# EAGLE design Enable Circuit (EAGLE 7.5.0)
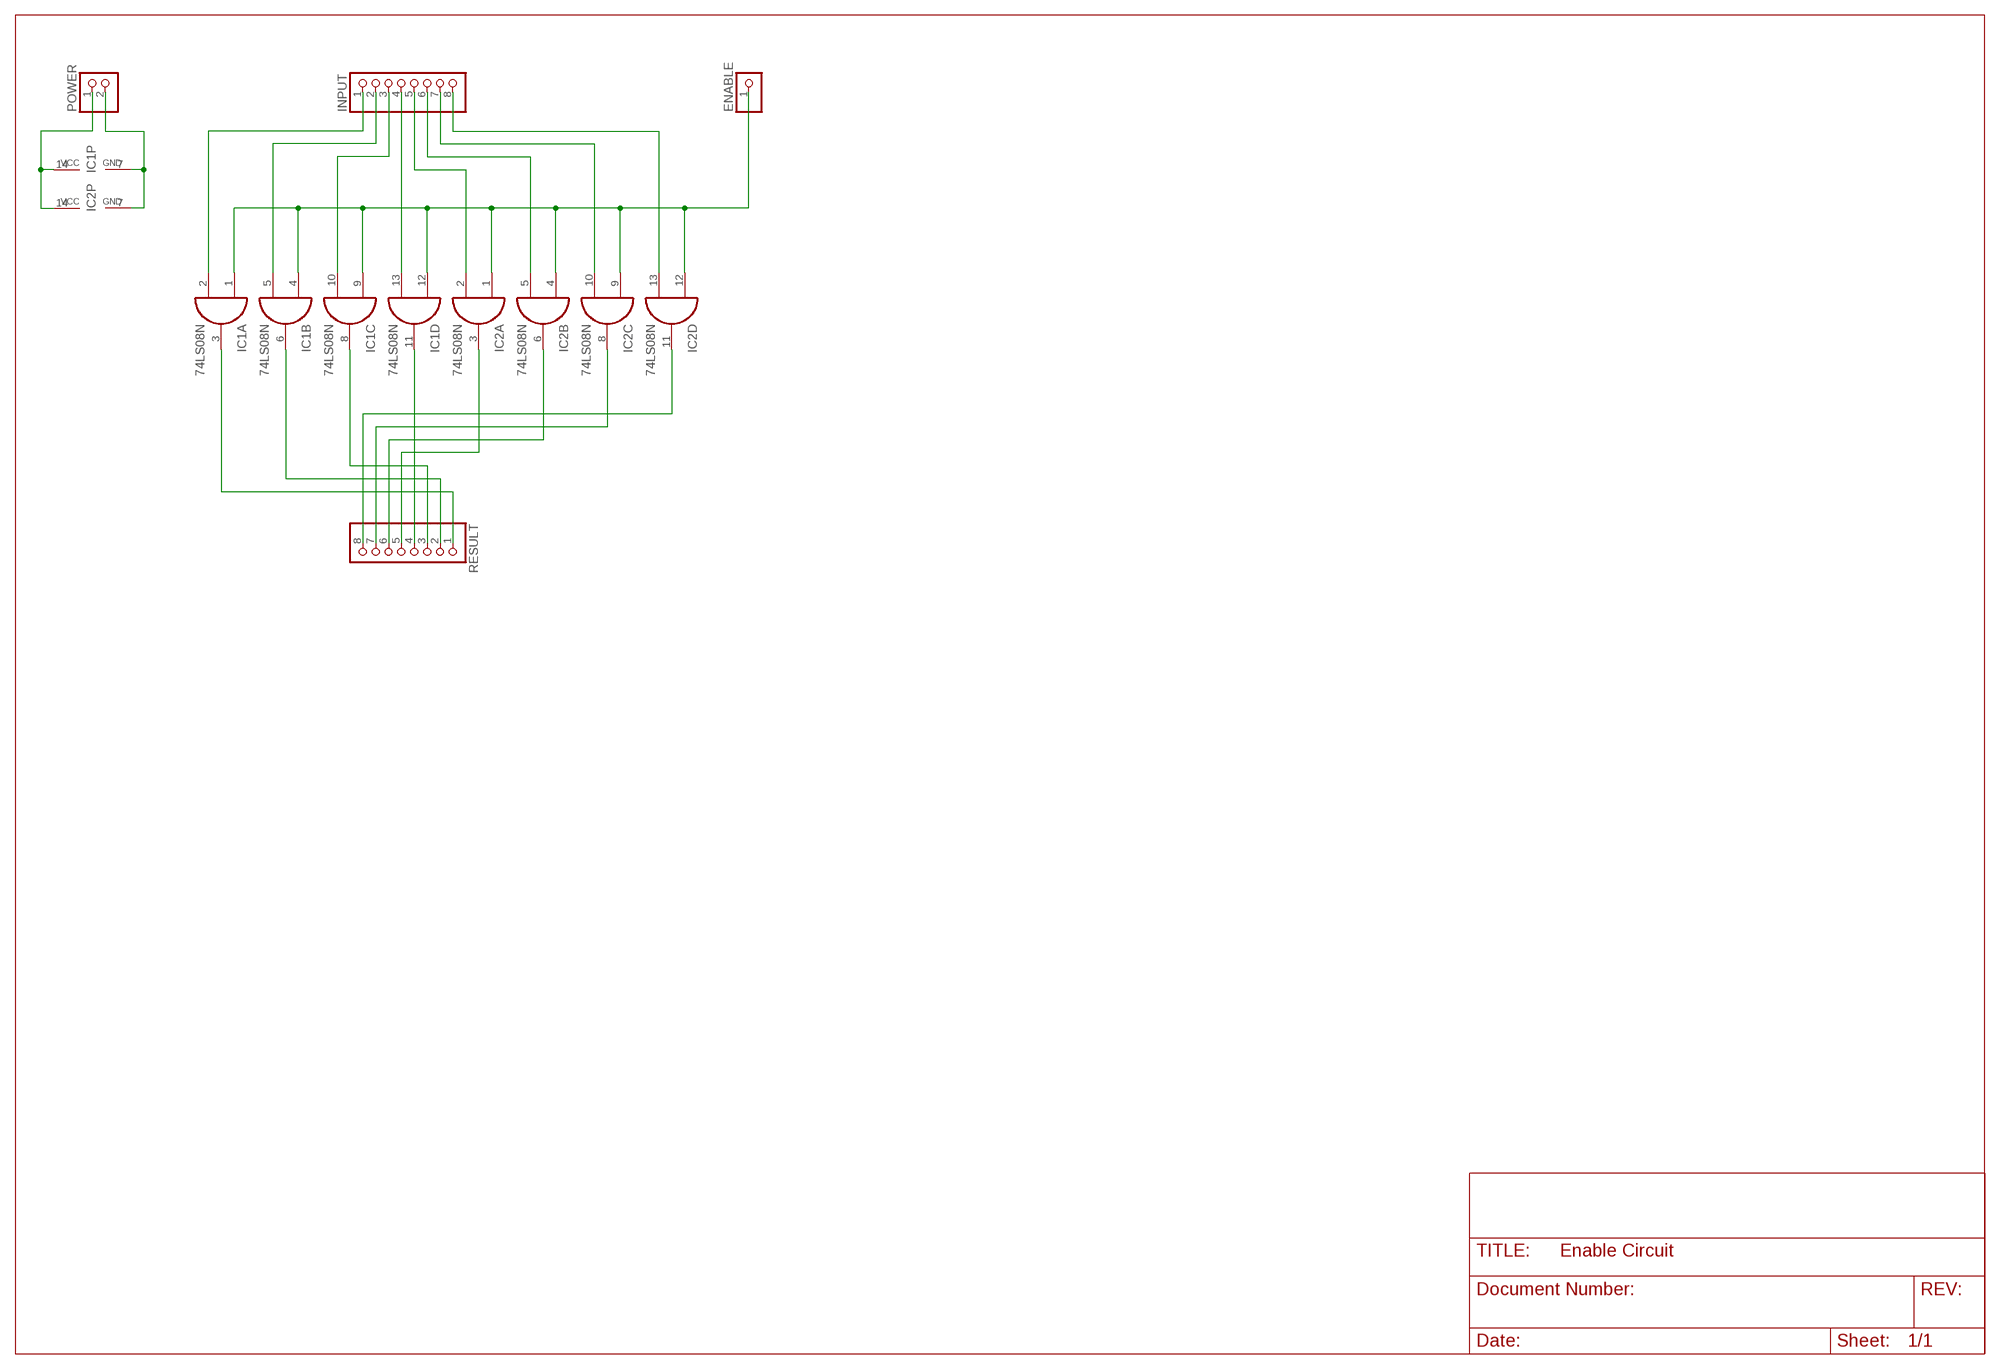
[diagram p0: schematic, sheet 1]

## Parts
ENABLE  PINHD-1X1  [1X01]
IC1  74LS08N  [DIL14]
IC2  74LS08N  [DIL14]
INPUT  PINHD-1X8  [1X08]
POWER  PINHD-1X2  [1X02]
RESULT  PINHD-1X8  [1X08]

## Nets
GND: IC1.7(P:GND) IC2.7(P:GND) POWER.2
N$1: IC1.2(A:I1) INPUT.1
N$2: IC1.5(B:I1) INPUT.2
N$3: IC1.10(C:I1) INPUT.3
N$4: IC1.13(D:I1) INPUT.4
N$5: IC2.2(A:I1) INPUT.5
N$6: IC2.5(B:I1) INPUT.6
N$7: IC2.10(C:I1) INPUT.7
N$8: IC2.13(D:I1) INPUT.8
N$9: ENABLE.1 IC1.1(A:I0) IC1.4(B:I0) IC1.9(C:I0) IC1.12(D:I0) IC2.1(A:I0) IC2.4(B:I0) IC2.9(C:I0) IC2.12(D:I0)
N$10: IC1.3(A:O) RESULT.1
N$11: IC1.6(B:O) RESULT.2
N$12: IC1.8(C:O) RESULT.3
N$13: IC1.11(D:O) RESULT.4
N$14: IC2.3(A:O) RESULT.5
N$15: IC2.6(B:O) RESULT.6
N$16: IC2.8(C:O) RESULT.7
N$17: IC2.11(D:O) RESULT.8
VCC: IC1.14(P:VCC) IC2.14(P:VCC) POWER.1

## Library data of the parts
ENABLE = pinhead:PINHD-1X1: PIN HEADER
IC1 IC2 = 74xx-eu:74*08: Quad 2-input AND gate
INPUT RESULT = pinhead:PINHD-1X8: PIN HEADER
POWER = pinhead:PINHD-1X2: PIN HEADER

## Board
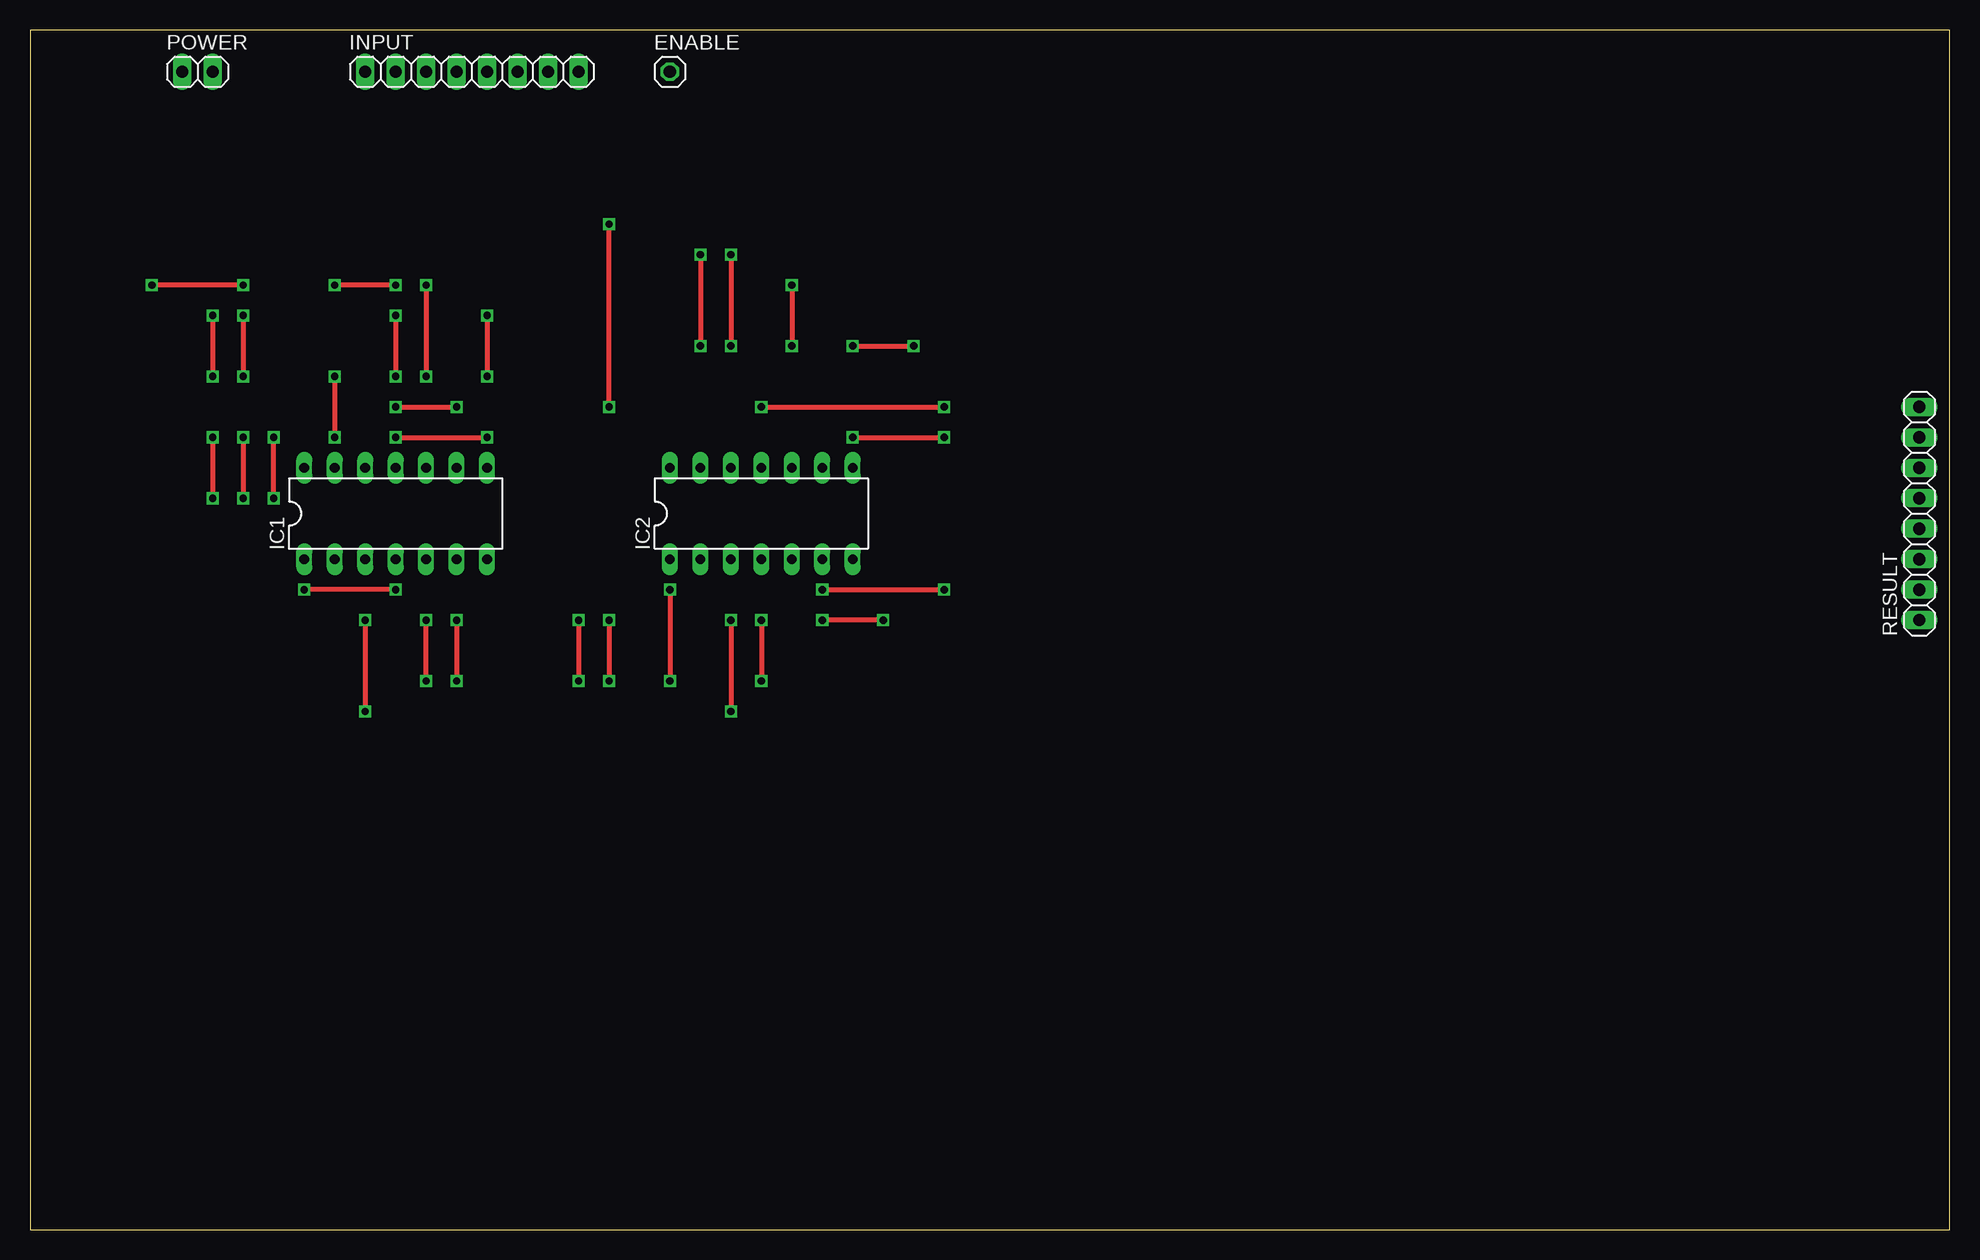
[diagram p1: board, top side]
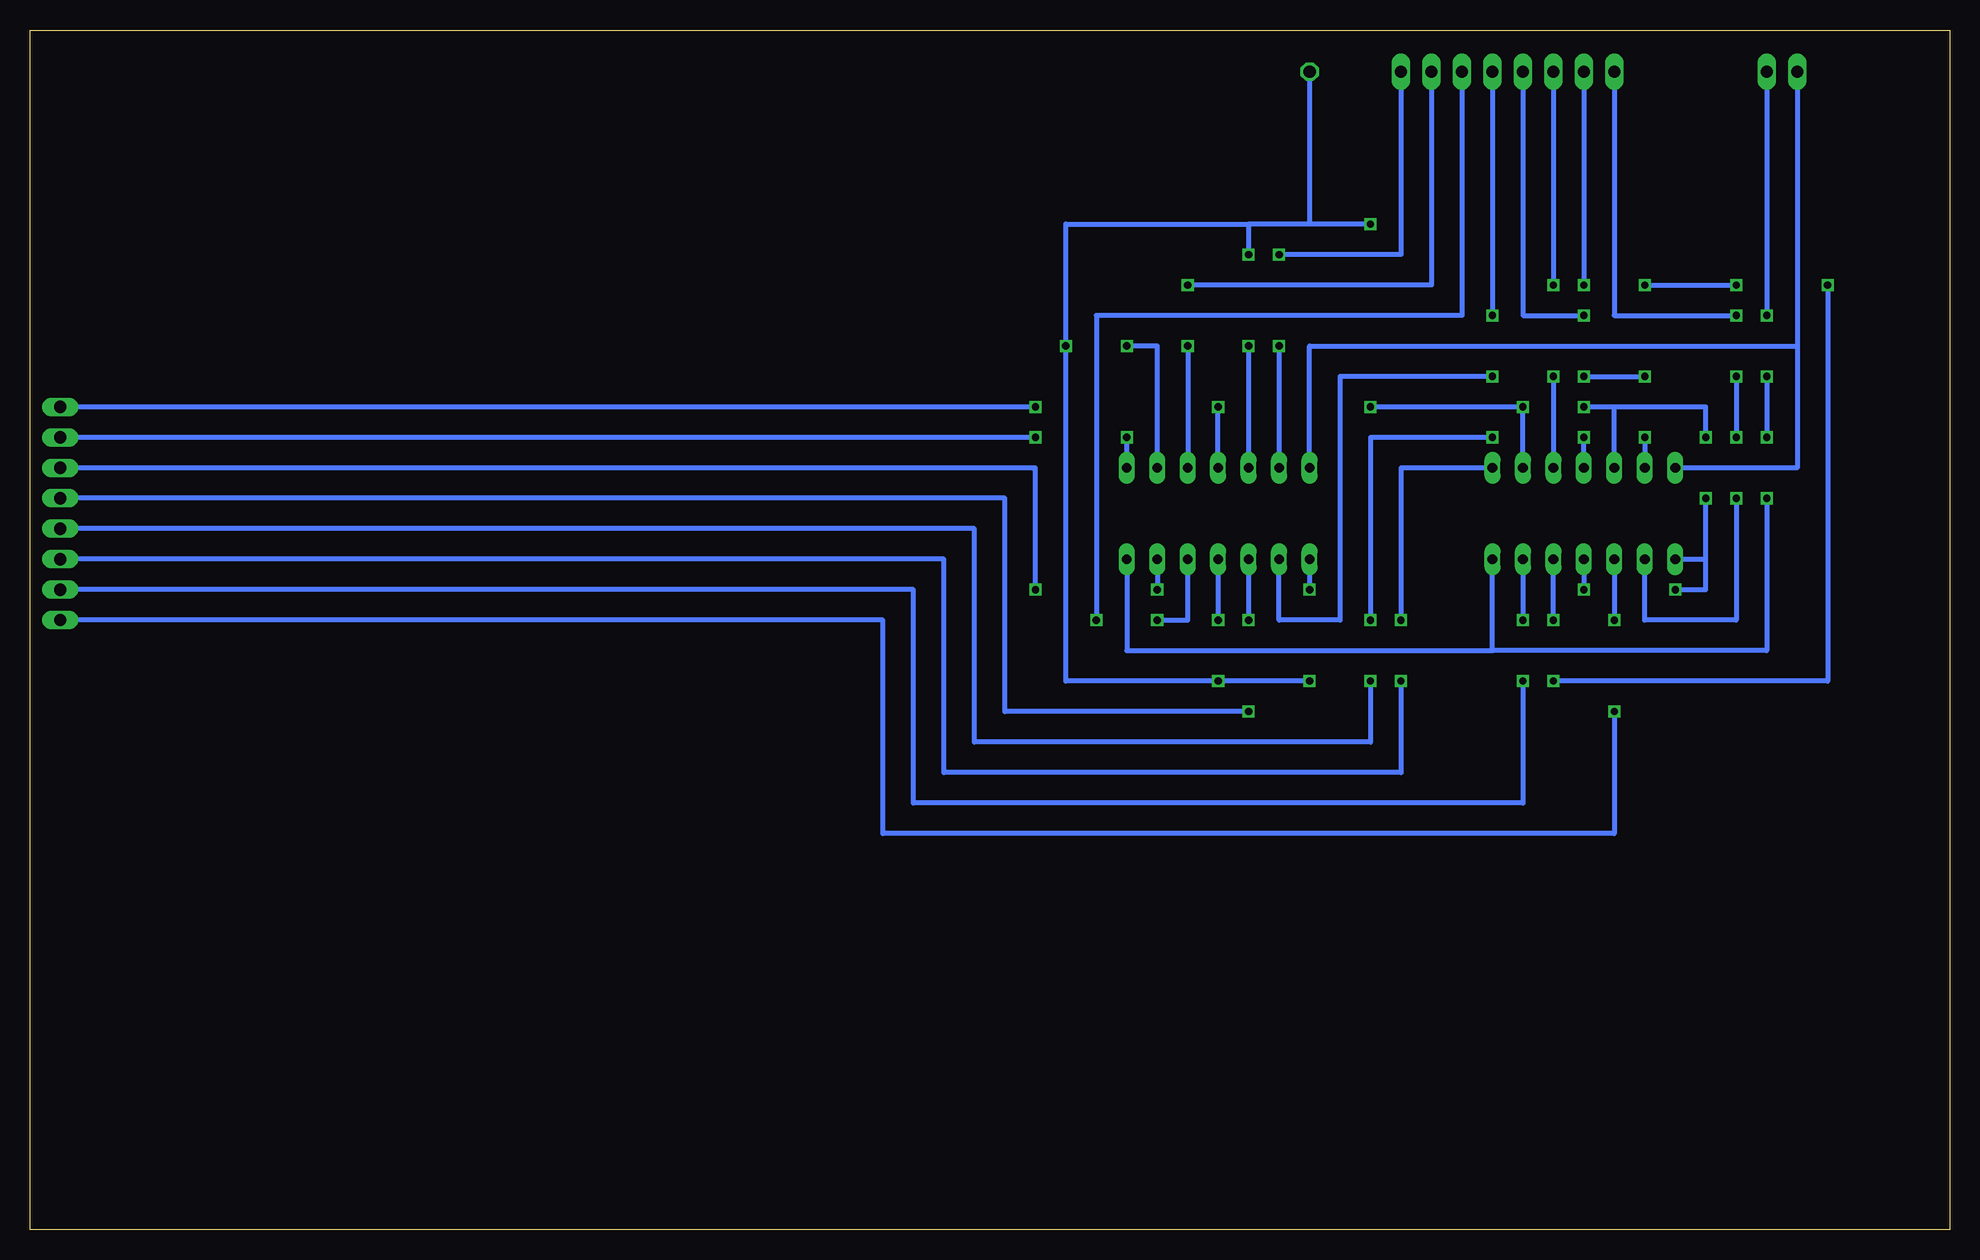
[diagram p2: board, bottom side, seen from below]

Size 160 x 100 mm. Coordinates in mm from the lower left corner, seen from the top.
Outline: 0,0 160,0 160,100 0,100 0,0
Copper layers (1*16): Top 0.035mm / dielectric 1.5mm / Bottom 0.035mm
Design rules "default": minimum track width 10mil, minimum drill 24mil, track to track 8mil, track to pad 8mil, pad to pad 8mil, via to via 8mil, smd to smd 8mil, copper to edge 40mil, drill to drill 8mil, minimum pad ring 10mil, minimum via ring 8mil, stop-mask expansion 4mil, vias tented up to drill 0mil, thermal gap 10mil

### Footprints (pad centres in the part's own frame; a part is rotated, then mirrored left to right if it is on the bottom)
1X01 = drill 1.016 octagon: 1 0,0
DIL14 = drill 0.813 long: 1 -7.62,-3.81; 2 -5.08,-3.81; 3 -2.54,-3.81; 4 0,-3.81; 5 2.54,-3.81; 6 5.08,-3.81; 7 7.62,-3.81; 8 7.62,3.81; 9 5.08,3.81; 10 2.54,3.81; 11 0,3.81; 12 -2.54,3.81; 13 -5.08,3.81; 14 -7.62,3.81
1X08 = drill 1.016 long: 1 -8.89,0; 2 -6.35,0; 3 -3.81,0; 4 -1.27,0; 5 1.27,0; 6 3.81,0; 7 6.35,0; 8 8.89,0
1X02 = drill 1.016 long: 1 -1.27,0; 2 1.27,0

### Placement (x,y rotation side)
ENABLE  53.34,96.52 0 top
IC1  30.48,59.69 0 top
IC2  60.96,59.69 0 top
INPUT  36.83,96.52 0 top
POWER  13.97,96.52 0 top
RESULT  157.48,59.69 90 top

### Tracks (layer width: path | path; a pad name or v marks a point on that pad's centre or on a via)
GND  (via drill 0.6)
  Top 0.406: v15.24,76.2 v15.24,71.12 | v15.24,66.04 v15.24,60.96
  Bottom 0.406: POWER.2 v15.24,76.2 | v15.24,71.12 v15.24,66.04 | v15.24,60.96 15.24,48.26 38.1,48.26 | 38.1,48.26 IC1.7 | IC2.7 68.58,48.26 38.1,48.26
N$1  (via drill 0.6)
  Top 0.406: v17.78,76.2 v17.78,71.12 | v17.78,66.04 v17.78,60.96
  Bottom 0.406: INPUT.1 27.94,76.2 v17.78,76.2 | v17.78,71.12 v17.78,66.04 | v17.78,60.96 17.78,50.8 25.4,50.8 IC1.2
N$2  (via drill 0.6)
  Top 0.406: v30.48,78.74 v25.4,78.74 | v17.78,78.74 v10.16,78.74 | v33.02,45.72 v33.02,50.8
  Bottom 0.406: INPUT.2 v30.48,78.74 | v25.4,78.74 v17.78,78.74 | v10.16,78.74 10.16,45.72 v33.02,45.72 | v33.02,50.8 IC1.5
N$3  (via drill 0.6)
  Top 0.406: v33.02,78.74 v33.02,71.12
  Bottom 0.406: INPUT.3 v33.02,78.74 | v33.02,71.12 IC1.10
N$4  (via drill 0.6)
  Top 0.406: v30.48,76.2 v30.48,71.12 | v25.4,71.12 v25.4,66.04
  Bottom 0.406: INPUT.4 35.56,76.2 v30.48,76.2 | v30.48,71.12 v25.4,71.12 | v25.4,66.04 IC1.13
N$5  (via drill 0.6)
  Top 0.406: v38.1,76.2 v38.1,71.12
  Bottom 0.406: INPUT.5 v38.1,76.2 | v38.1,71.12 50.8,71.12 50.8,50.8 55.88,50.8 IC2.2
N$6  (via drill 0.6)
  Top 0.406: v71.12,50.8 v66.04,50.8
  Bottom 0.406: INPUT.6 40.64,76.2 71.12,76.2 v71.12,50.8 | v66.04,50.8 63.5,50.8 IC2.5
N$7  (via drill 0.6)
  Top 0.406: v63.5,78.74 v63.5,73.66
  Bottom 0.406: INPUT.7 43.18,78.74 v63.5,78.74 | v63.5,73.66 IC2.10
N$8  (via drill 0.6)
  Top 0.406: v55.88,81.28 v55.88,73.66
  Bottom 0.406: INPUT.8 45.72,81.28 v55.88,81.28 | v55.88,73.66 IC2.13
N$9  (via drill 0.6)
  Top 0.406: v58.42,81.28 v58.42,73.66 | v30.48,68.58 v35.56,68.58 | v48.26,68.58 v48.26,83.82 | v30.48,53.34 v22.86,53.34 | v20.32,60.96 v20.32,66.04 | v53.34,53.34 v53.34,45.72 | v68.58,73.66 v73.66,73.66 | v60.96,50.8 v60.96,45.72
  Bottom 0.406: ENABLE.1 53.34,83.82 | 53.34,83.82 58.42,83.82 | 58.42,83.82 v58.42,81.28 | v58.42,73.66 IC2.12 | IC1.12 27.94,68.58 | 27.94,68.58 v30.48,68.58 | v48.26,68.58 v35.56,68.58 IC1.9 | v48.26,83.82 53.34,83.82 | IC1.4 v30.48,53.34 | v22.86,53.34 20.32,53.34 20.32,55.88 | 20.32,55.88 v20.32,60.96 | v20.32,66.04 20.32,68.58 27.94,68.58 | IC2.1 v53.34,53.34 | v53.34,45.72 v60.96,45.72 73.66,45.72 v73.66,73.66 73.66,83.82 58.42,83.82 | IC2.4 v60.96,50.8 | IC1.1 20.32,55.88 | IC2.9 66.04,73.66 v68.58,73.66
N$10  (via drill 0.6)
  Top 0.406: v27.94,50.8 v27.94,43.18
  Bottom 0.406: IC1.3 v27.94,50.8 | v27.94,43.18 27.94,33.02 88.9,33.02 88.9,50.8 RESULT.1
N$11  (via drill 0.6)
  Top 0.406: v35.56,50.8 v35.56,45.72
  Bottom 0.406: IC1.6 v35.56,50.8 | v35.56,45.72 35.56,35.56 86.36,35.56 86.36,53.34 RESULT.2
N$12  (via drill 0.6)
  Top 0.406: v45.72,50.8 v45.72,45.72
  Bottom 0.406: IC1.8 45.72,63.5 v45.72,50.8 | v45.72,45.72 45.72,38.1 83.82,38.1 83.82,55.88 RESULT.3
N$13  (via drill 0.6)
  Top 0.406: v30.48,66.04 v38.1,66.04 | v48.26,50.8 v48.26,45.72
  Bottom 0.406: IC1.11 v30.48,66.04 | v38.1,66.04 48.26,66.04 v48.26,50.8 | v48.26,45.72 48.26,40.64 81.28,40.64 81.28,58.42 RESULT.4
N$14  (via drill 0.6)
  Top 0.406: v58.42,50.8 v58.42,43.18
  Bottom 0.406: IC2.3 v58.42,50.8 | v58.42,43.18 78.74,43.18 78.74,60.96 RESULT.5
N$15  (via drill 0.6)
  Top 0.406: v66.04,53.34 v76.2,53.34
  Bottom 0.406: IC2.6 v66.04,53.34 | v76.2,53.34 76.2,63.5 RESULT.6
N$16  (via drill 0.6)
  Top 0.406: v68.58,66.04 v76.2,66.04
  Bottom 0.406: IC2.8 v68.58,66.04 | v76.2,66.04 RESULT.7
N$17  (via drill 0.6)
  Top 0.406: v60.96,68.58 v76.2,68.58
  Bottom 0.406: IC2.11 v60.96,68.58 | v76.2,68.58 RESULT.8
VCC
  Bottom 0.406: POWER.1 12.7,73.66 | 12.7,73.66 12.7,63.5 IC1.14 | IC2.14 53.34,73.66 12.7,73.66